# EAGLE design PLT-01-RevA (EAGLE 9.6.2)
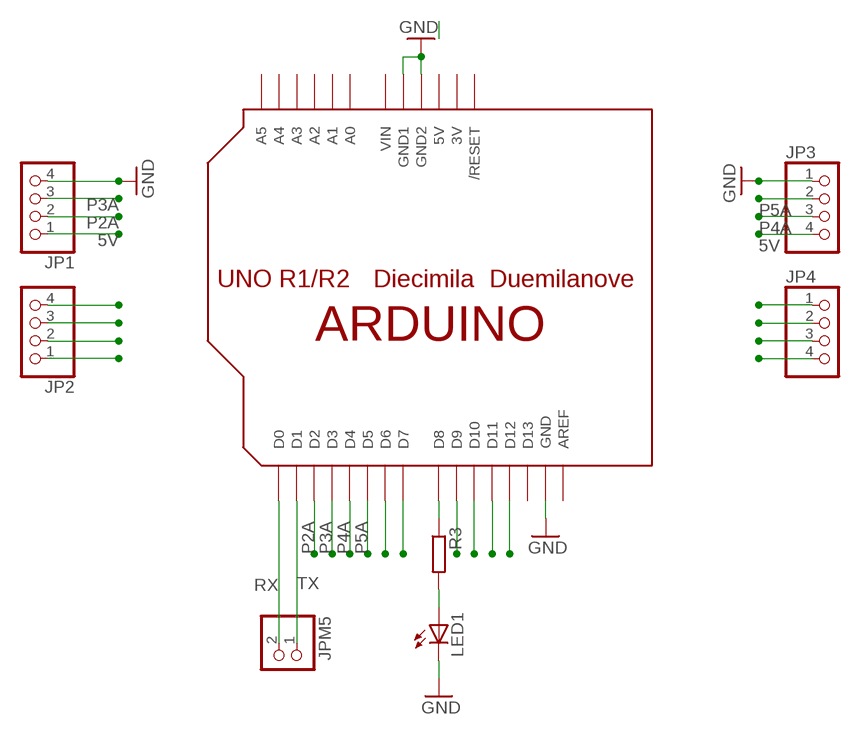
[diagram p0: schematic, sheet 1]

## Parts
JP1  PINHD-1X4  [1X04]
JP2  PINHD-1X4  [1X04]
JP3  PINHD-1X4  [1X04]
JP4  PINHD-1X4  [1X04]
JPM5  PINHD-1X2  [1X02]
LED1  LED5MM  [LED5MM]
R3  R-EU_0207/10  [0207/10]
U$1  ARDUINOUNO  [ARDUINO]

## Nets
5V: JP1.1 JP3.4
GND: JP1.4 JP3.1 LED1.K(C) U$1.GND U$1.GND1 U$1.GND2
N$4: JP2.4
N$5: JP2.2
N$8: JP4.1
N$9: JP4.3
N$10: R3.1 U$1.D8
N$12: LED1.A R3.2
N$14: JP2.3
N$15: JP2.1
N$17: JP4.2
N$19: JP4.4
N$30: U$1.D7
N$31: U$1.D10
N$32: U$1.D12
N$35: U$1.D6
N$36: U$1.D9
N$37: U$1.D11
P2A: JP1.2 U$1.D2
P3A: JP1.3 U$1.D3
P4A: JP3.3 U$1.D4
P5A: JP3.2 U$1.D5
RX: JPM5.2 U$1.D0
TX: JPM5.1 U$1.D1
Unconnected: U$1.A0 U$1.A1 U$1.A2 U$1.A3 U$1.A4 U$1.A5 U$1.AREF U$1.D13 U$1.RESET(/RESET)

## Power pins joined to a net without a drawn wire
3V: U$1.3V
5V: U$1.5V
VIN: U$1.VIN

## Library data of the parts
JP1-JP4 = pinhead:PINHD-1X4: PIN HEADER
JPM5 = pinhead:PINHD-1X2: PIN HEADER
LED1 = led:LED: LED OSRAM: - CHIPLED LG R971, LG N971, LY N971, LG Q971, LY Q971, LO R971, LY R971 LH N974, LH R974 LS Q976, LO Q976, LY Q976 LO Q996 - Hyper CHIPLED LW Q18S LB Q993, LB Q99A, LB R99A - SideLED LS A670, LO A670, LY A670, LG A670, LP A670 LB A673, LV A673, LT A673, LW A673 LH A674 LY A675 LS A676, LA A676, LO A676, LY A676, LW A676 LS A679, LY A679, LG A679 - Hyper Micro SIDELED® LS Y876, LA Y876, LO Y876, LY Y876 LT Y87S - SmartLED LW L88C, LW L88S LB L89C, LB L89S, LG L890 LS L89K, LO L89K, LY L89K LS L896, LA L896, LO L896, LY L896 - TOPLED LS T670, LO T670, LY T670, LG T670, LP T670 LSG T670, LSP T670, LSY T670, LOP T670, LYG T670 LG T671, LOG T671, LSG T671 LB T673, LV T673, LT T673, LW T673 LH T674 LS T676, LA T676, LO T676, LY T676, LB T676, LH T676, LSB T676, LW T676 LB T67C, LV T67C, LT T67C, LS T67K, LO T67K, LY T67K, LW E67C LS E67B, LA E67B, LO E67B, LY E67B, LB E67C, LV E67C, LT E67C LW T67C LS T679, LY T679, LG T679 LS T770, LO T770, LY T770, LG T770, LP T770 LB T773, LV T773, LT T773, LW T773 LH T774 LS E675, LA E675, LY E675, LS T675 LS T776, LA T776, LO T776, LY T776, LB T776 LHGB T686 LT T68C, LB T68C - Hyper Mini TOPLED® LB M676 - Mini TOPLED Santana® LG M470 LS M47K, LO M47K, LY M47K Source: http://www.osram.convergy.de LUXEON: - LUMILED® LXK2-PW12-R00, LXK2-PW12-S00, LXK2-PW14-U00, LXK2-PW14-V00 LXK2-PM12-R00, LXK2-PM12-S00, LXK2-PM14-U00 LXK2-PE12-Q00, LXK2-PE12-R00, LXK2-PE12-S00, LXK2-PE14-T00, LXK2-PE14-U00 LXK2-PB12-K00, LXK2-PB12-L00, LXK2-PB12-M00, LXK2-PB14-N00, LXK2-PB14-P00, LXK2-PB14-Q00 LXK2-PR12-L00, LXK2-PR12-M00, LXK2-PR14-Q00, LXK2-PR14-R00 LXK2-PD12-Q00, LXK2-PD12-R00, LXK2-PD12-S00 LXK2-PH12-R00, LXK2-PH12-S00 LXK2-PL12-P00, LXK2-PL12-Q00, LXK2-PL12-R00 Source: www.luxeon.com KINGBRIGHT: KA-3528ASYC Source: www.kingbright.com
R3 = resistor:R-EU_: RESISTOR, European symbol
U$1 = adafruit:ARDUINO: Arduino Diecimila/Duemilanove Make a shield with ease, this package has all the named pins as well as the two mounting drill holes and an outline of the USB and DC power connector. The outline is on the DIMENSION layer, so if your board house uses it they will cut the outline to match. http://www.ladyada.net/library/pcb/eaglelibrary.html

## Board
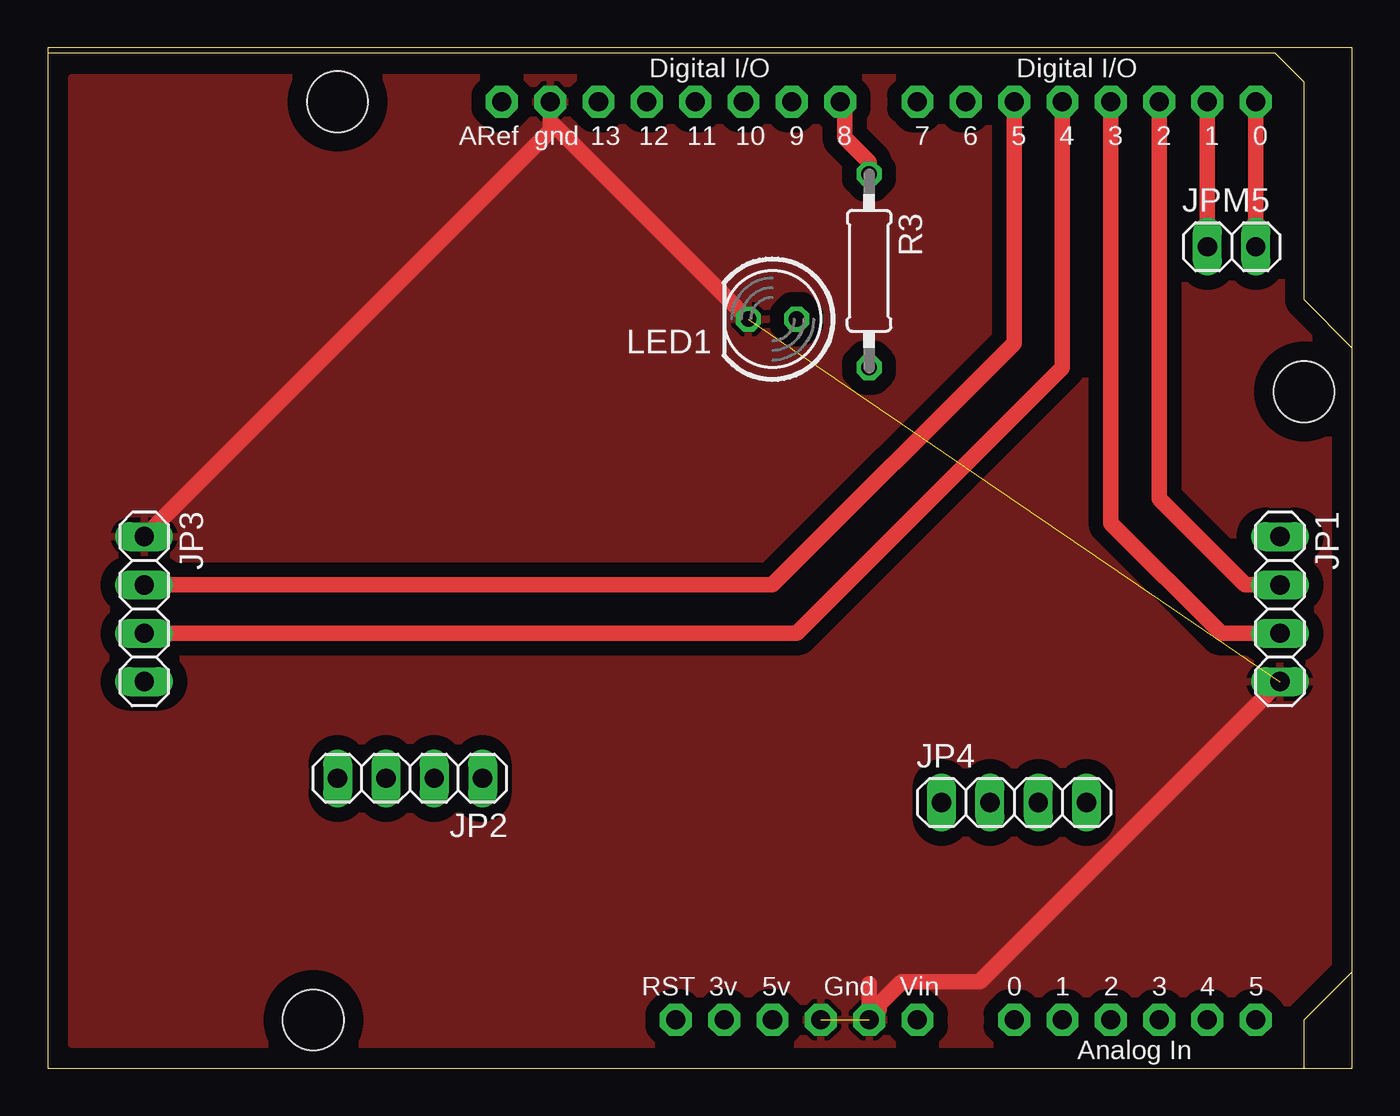
[diagram p1: board, top side]
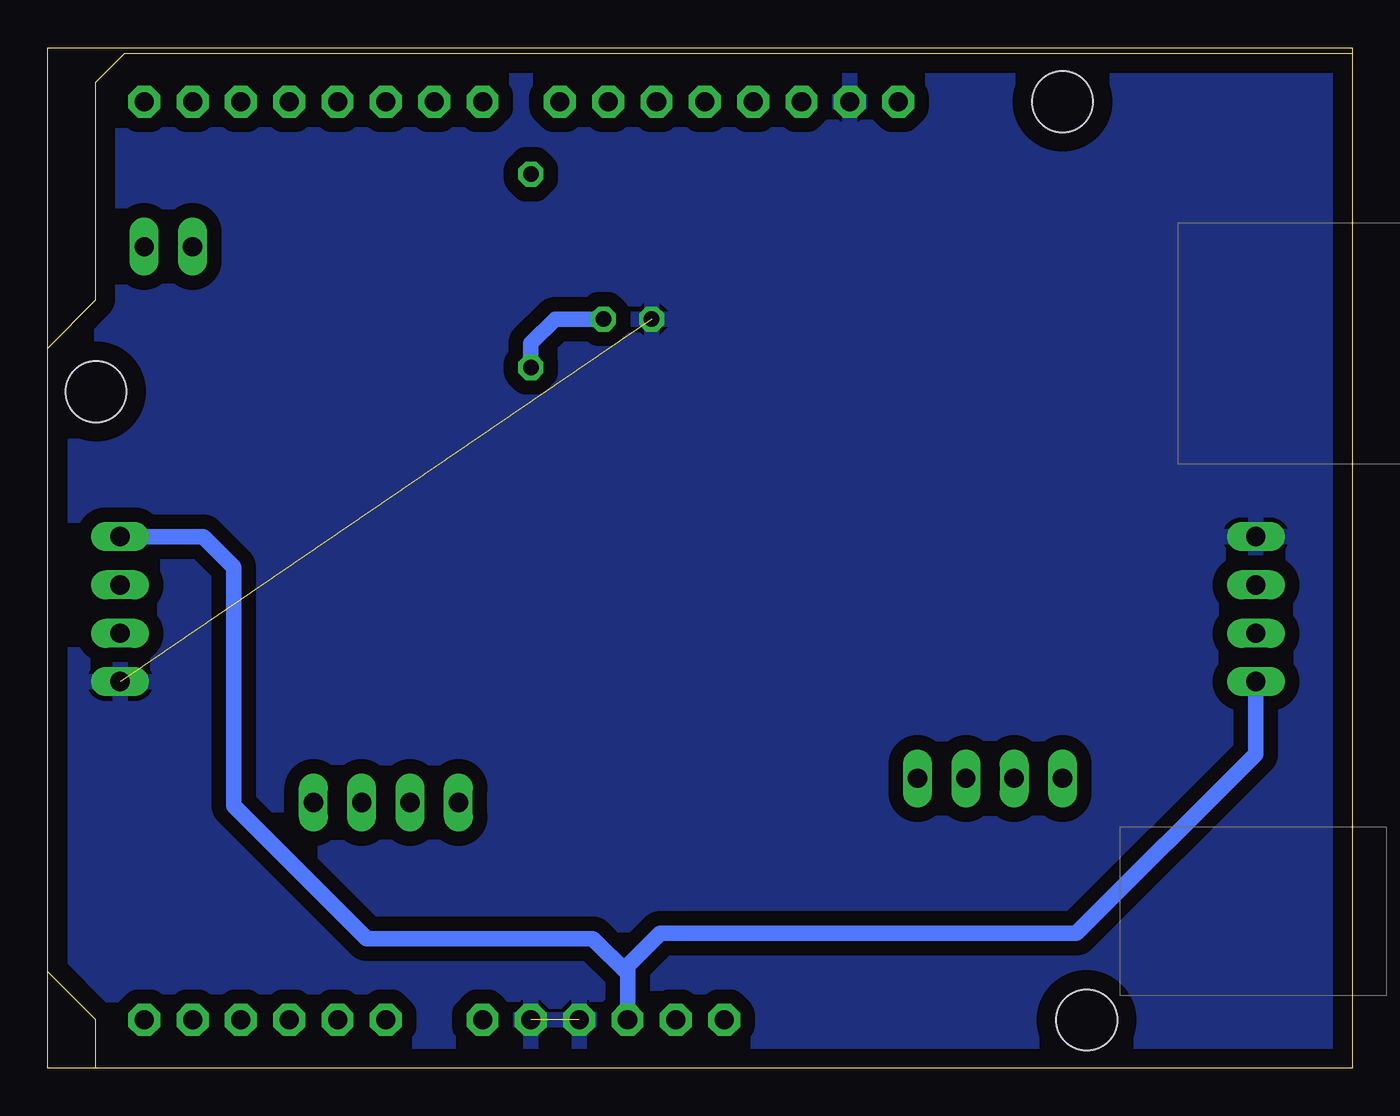
[diagram p2: board, bottom side, seen from below]

Size 68.58 x 53.64 mm. Coordinates in mm from the lower left corner, seen from the top.
Outline: 0,0 68.56,0 68.56,53.64 0,53.64 0,0
Copper layers (1*16): Top 0.035mm / dielectric 1.5mm / Bottom 0.035mm
Design rules "default *": minimum track width 10mil, minimum drill 24mil, track to track 30mil, track to pad 30mil, pad to pad 8mil, via to via 8mil, smd to smd 8mil, copper to edge 40mil, drill to drill 8mil, minimum pad ring 10mil, minimum via ring 8mil, stop-mask expansion 4mil, vias tented up to drill 0mil, thermal gap 10mil

### Footprints (pad centres in the part's own frame; a part is rotated, then mirrored left to right if it is on the bottom)
1X04 = drill 1.016 long: 1 -3.81,0; 2 -1.27,0; 3 1.27,0; 4 3.81,0
1X02 = drill 1.016 long: 1 -1.27,0; 2 1.27,0
LED5MM = drill 0.813 octagon: A -1.27,0; K 1.27,0
0207/10 = drill 0.813 octagon: 1 -5.08,0; 2 5.08,0
ARDUINO = drill 1 pad 1.676 octagon: 3V 35.56,2.54; 5V 38.1,2.54; A0 50.8,2.54; A1 53.34,2.54; A2 55.88,2.54; A3 58.42,2.54; A4 60.96,2.54; A5 63.5,2.54; AREF 23.876,50.8; D0 63.5,50.8; D1 60.96,50.8; D2 58.42,50.8; D3 55.88,50.8; D4 53.34,50.8; D5 50.8,50.8; D6 48.26,50.8; D7 45.72,50.8; D8 41.656,50.8; D9 39.116,50.8; D10 36.576,50.8; D11 34.036,50.8; D12 31.496,50.8; D13 28.956,50.8; GND 26.416,50.8; GND1 43.18,2.54; GND2 40.64,2.54; RESET 33.02,2.54; VIN 45.72,2.54 | hole 3.2: 15.24,50.8; 66.04,35.56; 13.97,2.54

### Placement (x,y rotation side)
JP1  64.77,24.13 270 top
JP2  19.05,15.24 180 top
JP3  5.08,24.13 270 top
JP4  50.8,13.97 0 top
JPM5  62.23,43.18 0 top
LED1  38.1,39.37 180 top
R3  43.18,41.91 270 top
U$1  0,0 0 top

### Tracks (layer width: path | path; a pad name or v marks a point on that pad's centre or on a via)
5V
  Bottom 0.813: JP1.1 60.4,27.94 58.8,26.34 58.8,13.79 51.81,6.81 39.92,6.81 38.1,4.98 U$1.5V 38.1,5.38 36.39,7.09 14.5,7.09 5.08,16.51 JP3.4
GND  (2 unrouted)
  Top 0.813: 43.18,4.45 U$1.GND1 43.71,3.07 43.71,3.37 44.89,4.55 49,4.55 JP1.4 | JP3.1 26.42,49.28 U$1.GND 26.42,49.78 LED1.K
  pour Top: 1.27,52.07 1.27,1.27 67.31,1.27 67.31,52.07
  pour Bottom: 1.27,52.07 1.27,5.08 1.27,1.27 67.31,1.27 67.31,52.07
N$10
  Top 0.813: R3.1 43.18,47.62 41.91,48.89 41.91,50.55 U$1.D8
N$12
  Bottom 0.813: LED1.A 41.91,39.37 43.18,38.1 R3.2
P2A
  Top 0.813: JP1.2 62.94,25.4 58.42,29.92 U$1.D2
P3A
  Top 0.813: JP1.3 61.67,22.86 55.88,28.65 U$1.D3
P4A
  Top 0.254: JP3.3 5.33,23.11 5.33,22.86
  Top 0.813: U$1.D4 53.34,36.83 39.37,22.86 5.33,22.86 JP3.3 4.98,22.86
P5A
  Top 0.813: U$1.D5 50.8,38.1 38.1,25.4 JP3.2
RX
  Top 0.813: JPM5.2 U$1.D0
TX
  Top 0.813: JPM5.1 U$1.D1